# EAGLE design voltage_multiplier_v10 (EAGLE 6.5.0)
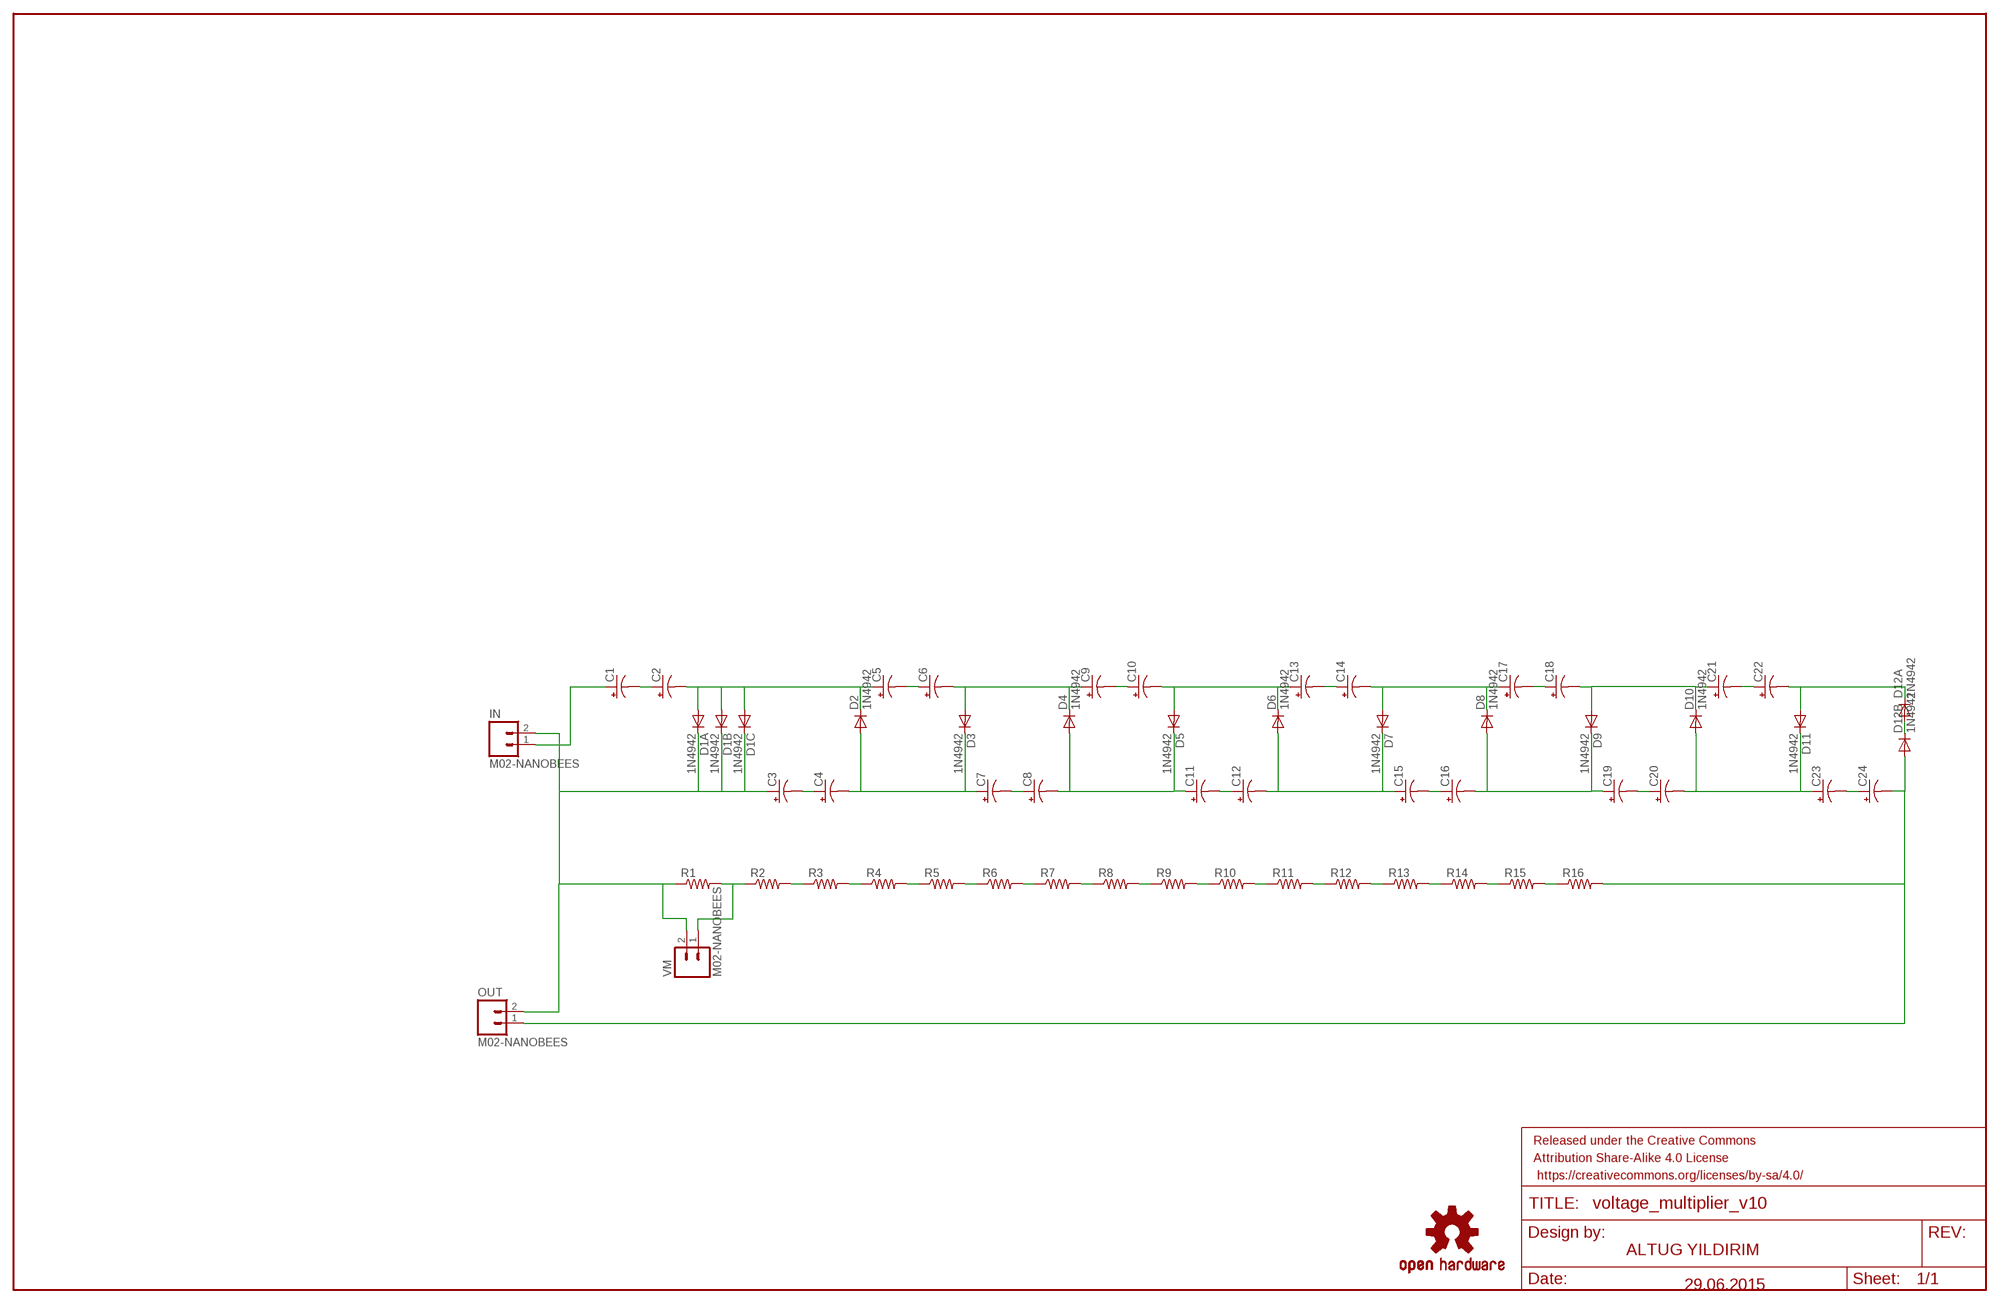
[diagram p0: schematic, sheet 1]

## Parts
C1  CAP_POLPTH3  [CPOL-RADIAL-1000UF-63V]
C2  CAP_POLPTH3  [CPOL-RADIAL-1000UF-63V]
C3  CAP_POLPTH3  [CPOL-RADIAL-1000UF-63V]
C4  CAP_POLPTH3  [CPOL-RADIAL-1000UF-63V]
C5  CAP_POLPTH3  [CPOL-RADIAL-1000UF-63V]
C6  CAP_POLPTH3  [CPOL-RADIAL-1000UF-63V]
C7  CAP_POLPTH3  [CPOL-RADIAL-1000UF-63V]
C8  CAP_POLPTH3  [CPOL-RADIAL-1000UF-63V]
C9  CAP_POLPTH3  [CPOL-RADIAL-1000UF-63V]
C10  CAP_POLPTH3  [CPOL-RADIAL-1000UF-63V]
C11  CAP_POLPTH3  [CPOL-RADIAL-1000UF-63V]
C12  CAP_POLPTH3  [CPOL-RADIAL-1000UF-63V]
C13  CAP_POLPTH3  [CPOL-RADIAL-1000UF-63V]
C14  CAP_POLPTH3  [CPOL-RADIAL-1000UF-63V]
C15  CAP_POLPTH3  [CPOL-RADIAL-1000UF-63V]
C16  CAP_POLPTH3  [CPOL-RADIAL-1000UF-63V]
C17  CAP_POLPTH3  [CPOL-RADIAL-1000UF-63V]
C18  CAP_POLPTH3  [CPOL-RADIAL-1000UF-63V]
C19  CAP_POLPTH3  [CPOL-RADIAL-1000UF-63V]
C20  CAP_POLPTH3  [CPOL-RADIAL-1000UF-63V]
C21  CAP_POLPTH3  [CPOL-RADIAL-1000UF-63V]
C22  CAP_POLPTH3  [CPOL-RADIAL-1000UF-63V]
C23  CAP_POLPTH3  [CPOL-RADIAL-1000UF-63V]
C24  CAP_POLPTH3  [CPOL-RADIAL-1000UF-63V]
D1A  1N4942  [DO41-10]
D1B  1N4942  [DO41-10]
D1C  1N4942  [DO41-10]
D2  1N4942  [DO41-10]
D3  1N4942  [DO41-10]
D4  1N4942  [DO41-10]
D5  1N4942  [DO41-10]
D6  1N4942  [DO41-10]
D7  1N4942  [DO41-10]
D8  1N4942  [DO41-10]
D9  1N4942  [DO41-10]
D10  1N4942  [DO41-10]
D11  1N4942  [DO41-10]
D12A  1N4942  [DO41-10]
D12B  1N4942  [DO41-10]
FRAME1  FRAME-LEDGER  [CREATIVE_COMMONS]
IN  M02-NANOBEES  [M02-NANOBEES]
LOGO1  OSHW-LOGOM  [OSHW-LOGO-M]
OUT  M02-NANOBEES  [M02-NANOBEES]
R1  RESISTORPTH-1/4W  [AXIAL-0.4]
R2  RESISTORPTH-1/4W  [AXIAL-0.4]
R3  RESISTORPTH-1/4W  [AXIAL-0.4]
R4  RESISTORPTH-1/4W  [AXIAL-0.4]
R5  RESISTORPTH-1/4W  [AXIAL-0.4]
R6  RESISTORPTH-1/4W  [AXIAL-0.4]
R7  RESISTORPTH-1/4W  [AXIAL-0.4]
R8  RESISTORPTH-1/4W  [AXIAL-0.4]
R9  RESISTORPTH-1/4W  [AXIAL-0.4]
R10  RESISTORPTH-1/4W  [AXIAL-0.4]
R11  RESISTORPTH-1/4W  [AXIAL-0.4]
R12  RESISTORPTH-1/4W  [AXIAL-0.4]
R13  RESISTORPTH-1/4W  [AXIAL-0.4]
R14  RESISTORPTH-1/4W  [AXIAL-0.4]
R15  RESISTORPTH-1/4W  [AXIAL-0.4]
R16  RESISTORPTH-1/4W  [AXIAL-0.4]
VM  M02-NANOBEES  [M02-NANOBEES]

## Nets
N$1: C5.2(-) C6.1(+)
N$2: C2.2(-) C5.1(+) D1A.A D1B.A D1C.A D2.C
N$3: C1.2(-) C2.1(+)
N$4: C3.1(+) D1A.C D1B.C D1C.C IN.2 OUT.2 R1.P$1 VM.2
N$5: C3.2(-) C4.1(+)
N$6: C4.2(-) C7.1(+) D2.A D3.C
N$7: C1.1(+) IN.1
N$8: C6.2(-) C9.1(+) D3.A D4.C
N$9: C7.2(-) C8.1(+)
N$10: C9.2(-) C10.1(+)
N$11: C13.2(-) C14.1(+)
N$12: C8.2(-) C11.1(+) D4.A D5.C
N$13: C10.2(-) C13.1(+) D5.A D6.C
N$14: D12A.A D12B.C
N$15: C18.2(-) C21.1(+) D9.A D10.C
N$16: C11.2(-) C12.1(+)
N$17: C12.2(-) C15.1(+) D6.A D7.C
N$18: C14.2(-) C17.1(+) D7.A D8.C
N$19: C15.2(-) C16.1(+)
N$20: C17.2(-) C18.1(+)
N$21: C16.2(-) C19.1(+) D8.A D9.C
N$22: C24.2(-) D12B.A OUT.1 R16.P$2
N$23: C21.2(-) C22.1(+)
N$24: C19.2(-) C20.1(+)
N$25: C20.2(-) C23.1(+) D10.A D11.C
N$26: C22.2(-) D11.A D12A.C
N$27: C23.2(-) C24.1(+)
N$28: R1.P$2 R2.P$1 VM.1
N$29: R2.P$2 R3.P$1
N$30: R3.P$2 R4.P$1
N$31: R4.P$2 R5.P$1
N$32: R5.P$2 R6.P$1
N$33: R6.P$2 R7.P$1
N$34: R7.P$2 R8.P$1
N$35: R8.P$2 R9.P$1
N$36: R9.P$2 R10.P$1
N$37: R10.P$2 R11.P$1
N$38: R11.P$2 R12.P$1
N$39: R12.P$2 R13.P$1
N$40: R13.P$2 R14.P$1
N$41: R14.P$2 R15.P$1
N$42: R15.P$2 R16.P$1

## Notes on the sheet
- ALTUG YILDIRIM
- 29.06.2015

## Library data of the parts
C1-C24 = SparkFun-Capacitors:CAP_POL: Capacitor Polarized These are standard SMD and PTH capacitors. Normally 10uF, 47uF, and 100uF in electrolytic and tantalum varieties. Always verify the external diameter of the through hole cap, it varies with capacity, voltage, and manufacturer. The EIA devices should be standard.
D1A D1B D1C D2-D11 D12A D12B = diode:1N4942: DIODE 1.0 A, 200 V, 150 ns
FRAME1 = SparkFun-Aesthetics:FRAME-LEDGER: Schematic Frame Standard 11x14 US Ledger frame
IN OUT VM = SparkFun-Connectors:M02-NANOBEES
LOGO1 = SparkFun-Aesthetics:OSHW-LOGO: Open Source Hardware Logo This logo indicates the piece of hardware it is found on incorporates a OSHW license and/or adheres to the definition of open source hardware found here: http://freedomdefined.org/OSHW
R1-R16 = SparkFun-Resistors:RESISTOR: Resistor Basic schematic elements and footprints for 0603, 1206, and PTH resistors.

## Board
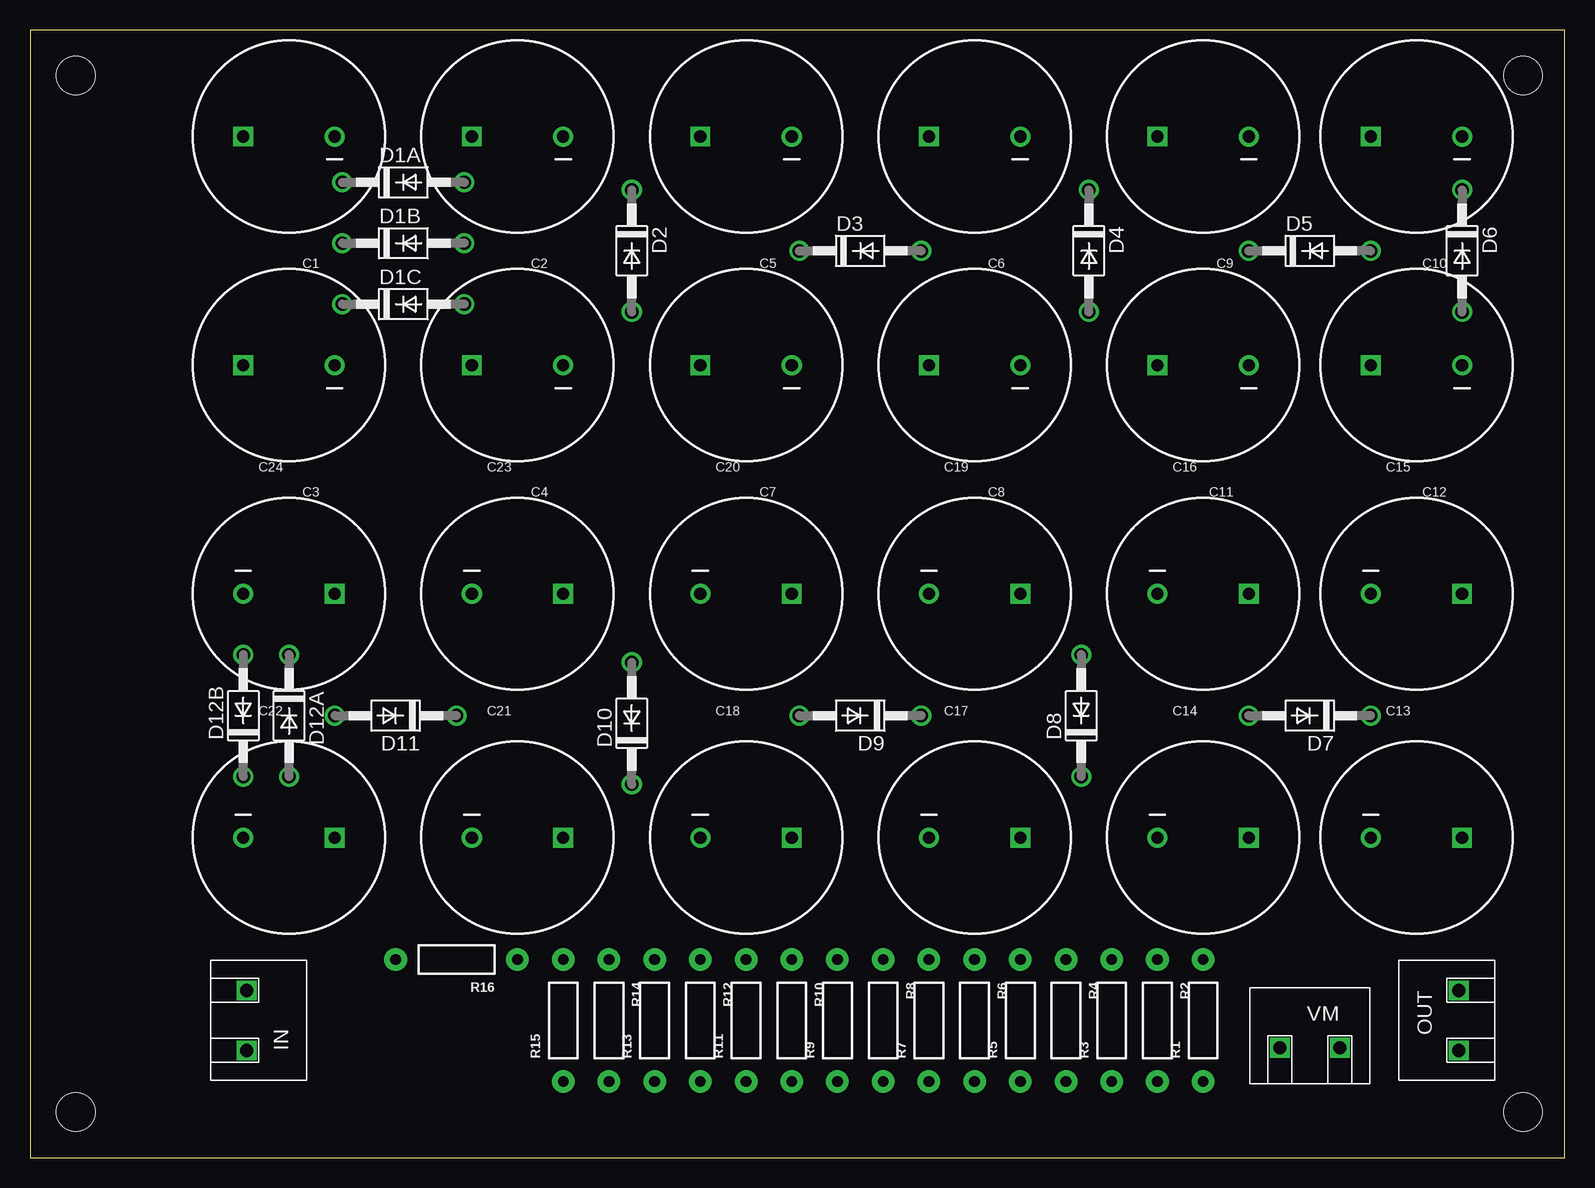
[diagram p1: board, top side]
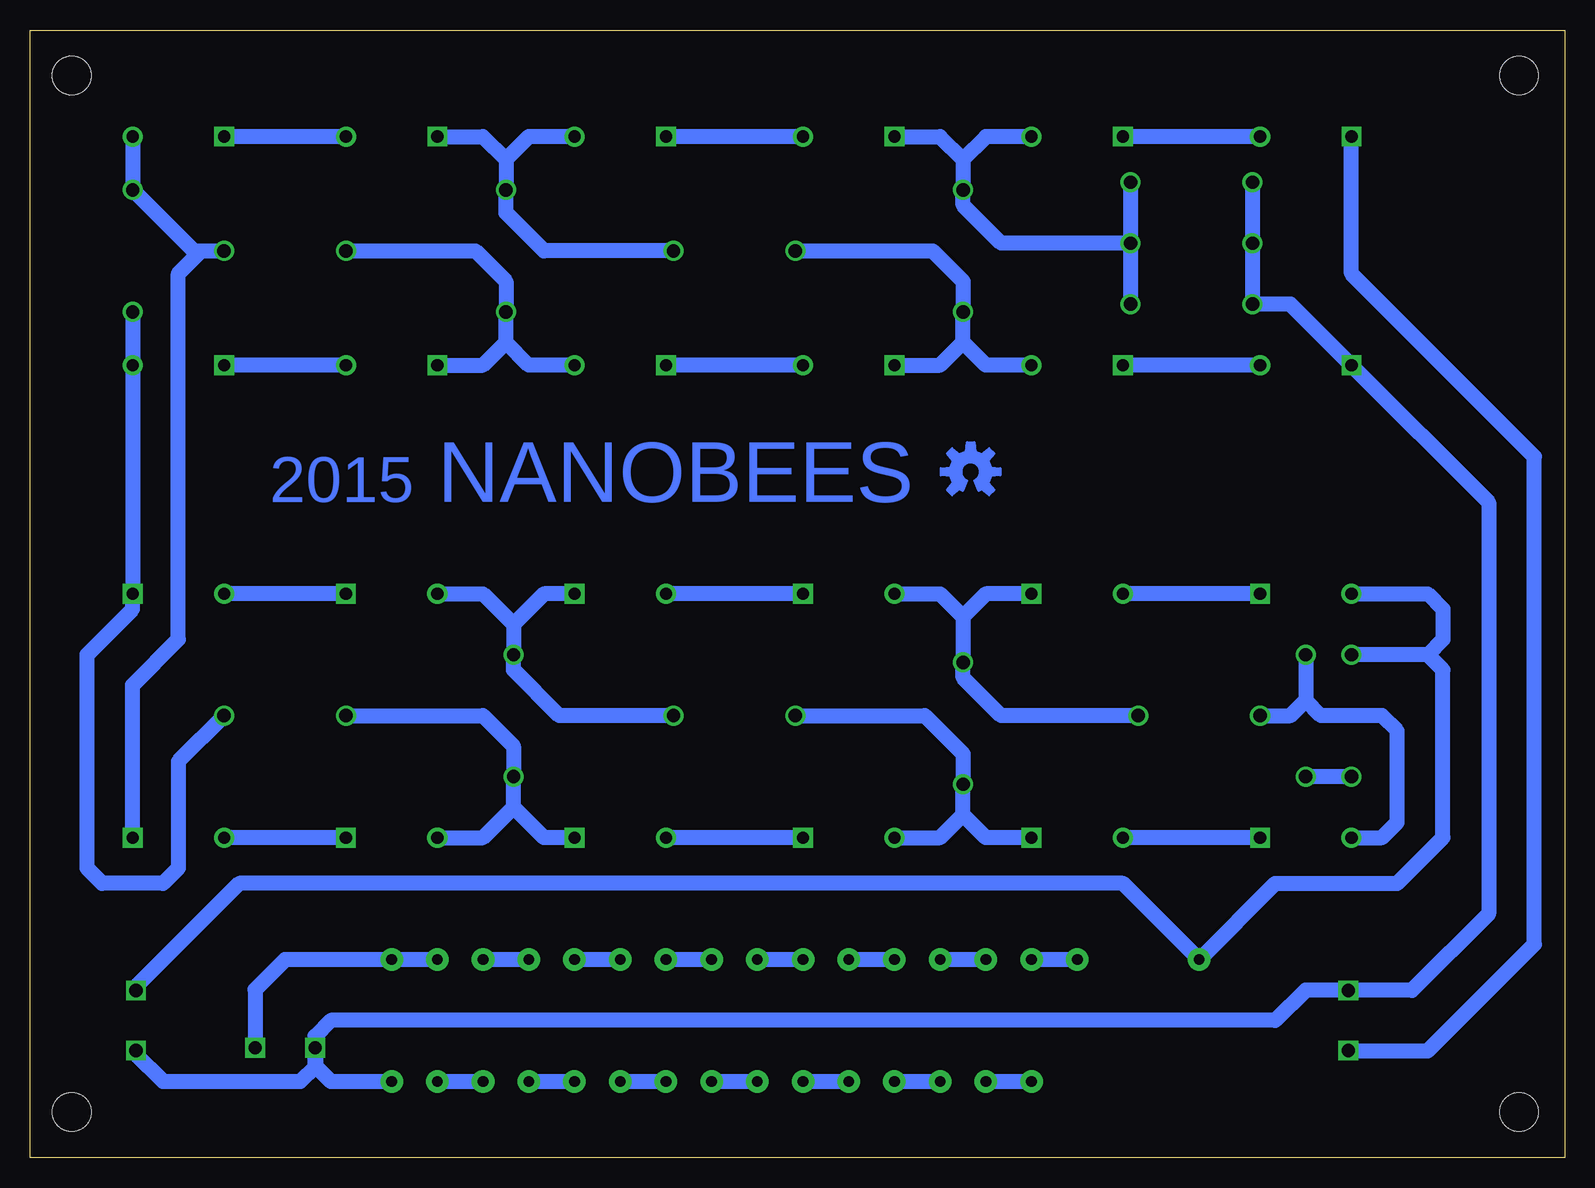
[diagram p2: board, bottom side, seen from below]

Size 127.94 x 93.97 mm. Coordinates in mm from the lower left corner, seen from the top.
Outline: 0,0 127.94,0 127.94,93.97 0,93.97 0,0
Copper layers (1*16): Top 0.035mm / dielectric 1.5mm / Bottom 0.035mm
Design rules "default": minimum track width 10mil, minimum drill 24mil, track to track 8mil, track to pad 8mil, pad to pad 8mil, via to via 8mil, smd to smd 8mil, copper to edge 40mil, drill to drill 8mil, minimum pad ring 10mil, minimum via ring 8mil, stop-mask expansion 4mil, vias tented up to drill 0mil, thermal gap 10mil
Holes 3.2 mm at 3.81,90.17 3.81,3.81 124.46,90.17 124.46,3.81

### Footprints (pad centres in the part's own frame; a part is rotated, then mirrored left to right if it is on the bottom)
CPOL-RADIAL-1000UF-63V = drill 1.016 pad 1.651 square: 1 3.81,0 | drill 1.016 pad 1.676: 2 -3.81,0
DO41-10 = drill 1.118: A 5.08,0; C -5.08,0
M02-NANOBEES = drill 1.1 pad 1.5 square: 1 -2.5,1; 2 2.5,1
AXIAL-0.4 = drill 0.9 pad 1.88: P$1 -5.08,0; P$2 5.08,0

### Placement (x,y rotation side)
C1  21.59,85.09 180 top
C2  40.64,85.09 180 top
C3  21.59,66.04 180 top
C4  40.64,66.04 180 top
C5  59.69,85.09 180 top
C6  78.74,85.09 180 top
C7  59.69,66.04 180 top
C8  78.74,66.04 180 top
C9  97.79,85.09 180 top
C10  115.57,85.09 180 top
C11  97.79,66.04 180 top
C12  115.57,66.04 180 top
C13  115.57,26.67 0 top
C14  97.79,26.67 0 top
C15  115.57,46.99 0 top
C16  97.79,46.99 0 top
C17  78.74,26.67 0 top
C18  59.69,26.67 0 top
C19  78.74,46.99 0 top
C20  59.69,46.99 0 top
C21  40.64,26.67 0 top
C22  21.59,26.67 0 top
C23  40.64,46.99 0 top
C24  21.59,46.99 0 top
D1A  31.12,81.28 0 top
D1B  31.12,76.2 0 top
D1C  31.12,71.12 0 top
D2  50.16,75.56 270 top
D3  69.22,75.56 0 top
D4  88.27,75.56 270 top
D5  106.68,75.56 0 top
D6  119.38,75.56 270 top
D7  106.68,36.83 180 top
D8  87.63,36.83 90 top
D9  69.22,36.83 180 top
D10  50.16,36.2 90 top
D11  30.48,36.83 180 top
D12A  21.59,36.83 270 top
D12B  17.78,36.83 90 top
FRAME1  39.37,-7.62 0 top  (outside the outline)
IN  19.05,11.43 90 top
LOGO1  49.53,57.15 0 top
OUT  118.11,11.43 270 top
R1  97.79,11.43 90 top
R2  93.98,11.43 270 top
R3  90.17,11.43 90 top
R4  86.36,11.43 270 top
R5  82.55,11.43 90 top
R6  78.74,11.43 270 top
R7  74.93,11.43 90 top
R8  71.12,11.43 270 top
R9  67.31,11.43 90 top
R10  63.5,11.43 270 top
R11  59.69,11.43 90 top
R12  55.88,11.43 270 top
R13  52.07,11.43 90 top
R14  48.26,11.43 270 top
R15  44.45,11.43 90 top
R16  35.56,16.51 180 top
VM  106.68,10.16 180 top

### Tracks (layer width: path | path; a pad name or v marks a point on that pad's centre or on a via)
N$1
  Bottom 1.27: C5.2 C6.1
N$2
  Bottom 1.27: D1B.A D1C.A | C5.1 52.07,85.09 50.16,83.19 | 50.16,83.19 D2.C 50.16,79.38 46.99,76.2 D1B.A | C2.2 48.26,85.09 50.16,83.19 | D1A.A D1B.A
N$3
  Bottom 1.27: C1.2 C2.1
N$4
  Bottom 1.27: D1A.C D1B.C D1C.C 22.86,71.12 C3.1 6.35,54.61 6.35,20.32 12.74,13.93 IN.2 18.09,13.97 21.59,13.97 24.13,11.43 102.87,11.43 104.18,10.12 VM.2 | VM.2 104.18,7.58 105.41,6.35 116.84,6.35 119.11,8.62 OUT.2 | VM.2 104.14,9.12 104.14,7.62 102.87,6.35 R1.P$1
N$5
  Bottom 1.27: C3.2 C4.1
N$6
  Bottom 1.27: C4.2 48.26,66.04 50.16,67.95 | 50.16,67.95 D2.A 50.16,73.03 52.7,75.56 D3.C | C7.1 52.07,66.04 50.16,67.95
N$7
  Bottom 1.27: IN.1 18.01,8.89 11.43,8.89 2.54,17.78 2.54,58.42 17.78,73.66 C1.1
N$8
  Bottom 1.27: C6.2 86.36,85.09 88.27,83.19 | 88.27,83.19 D4.C 88.27,78.74 85.09,75.56 D3.A | C9.1 90.17,85.09 88.27,83.19
N$9
  Bottom 1.27: C7.2 C8.1
N$10
  Bottom 1.27: C9.2 C10.1
N$11
  Bottom 1.27: C14.1 C13.2
N$12
  Bottom 1.27: C8.2 86.36,66.04 88.27,67.95 | 88.27,67.95 88.27,69.85 D4.A 88.27,73.03 90.81,75.56 D5.C | C11.1 90.17,66.04 88.27,67.95
N$13
  Bottom 1.27: 113.67,75.56 115.57,73.66 115.57,43.18 119.38,39.37 C13.1 | 113.67,75.56 D5.A | 113.67,75.56 114.3,75.56 D6.C C10.2
N$14
  Bottom 1.27: D12B.C D12A.A
N$15
  Bottom 1.27: C21.1 48.26,26.67 50.16,28.57 | 50.16,28.57 D10.C 50.16,33.66 53.34,36.83 D9.A | C18.2 52.07,26.67 50.16,28.57
N$16
  Bottom 1.27: C11.2 C12.1
N$17
  Bottom 1.27: D6.A C12.2 C15.1 119.38,45.72 123.19,41.91 123.19,24.13 121.92,22.86 116.84,22.86 115.57,24.13 115.57,33.02 D7.C
N$18
  Bottom 1.27: C17.1 85.09,26.67 87.63,29.21 | 87.63,29.21 D8.C 87.63,34.29 90.17,36.83 D7.A | C14.2 90.17,26.67 87.63,29.21
N$19
  Bottom 1.27: C16.1 C15.2
N$20
  Bottom 1.27: C18.1 C17.2
N$21
  Bottom 1.27: C19.1 85.09,46.99 87.63,44.45 | 87.63,44.45 D8.A 87.63,40.64 83.82,36.83 D9.C | C16.2 90.17,46.99 87.63,44.45
N$22
  Bottom 1.27: 11.43,41.91 10.16,40.64 10.16,26.67 13.97,22.86 24.13,22.86 R16.P$2 36.83,22.86 110.49,22.86 119.11,14.24 OUT.1 | 11.43,41.91 D12B.A | C24.2 11.43,46.99 10.16,45.72 10.16,43.18 11.43,41.91
N$23
  Bottom 1.27: C22.1 C21.2
N$24
  Bottom 1.27: C20.1 C19.2
N$25
  Bottom 1.27: C23.1 48.26,46.99 50.16,45.09 | 50.16,45.09 D10.A 50.16,40.01 46.99,36.83 D11.C | C20.2 52.07,46.99 50.16,45.09
N$26
  Bottom 1.27: C22.2 15.24,26.67 13.97,27.94 13.97,35.56 15.24,36.83 20.32,36.83 21.59,38.1 | D12A.C 21.59,38.1 | D11.A 22.86,36.83 21.59,38.1
N$27
  Bottom 1.27: C24.1 C23.2
N$28
  Bottom 1.27: VM.1 109.18,14.01 106.68,16.51 R1.P$2 R2.P$1
N$29
  Bottom 1.27: R2.P$2 R3.P$1
N$30
  Bottom 1.27: R4.P$1 R3.P$2
N$31
  Bottom 1.27: R4.P$2 R5.P$1
N$32
  Bottom 1.27: R6.P$1 R5.P$2
N$33
  Bottom 1.27: R6.P$2 R7.P$1
N$34
  Bottom 1.27: R8.P$1 R7.P$2
N$35
  Bottom 1.27: R8.P$2 R9.P$1
N$36
  Bottom 1.27: R10.P$1 R9.P$2
N$37
  Bottom 1.27: R10.P$2 R11.P$1
N$38
  Bottom 1.27: R12.P$1 R11.P$2
N$39
  Bottom 1.27: R12.P$2 R13.P$1
N$40
  Bottom 1.27: R14.P$1 R13.P$2
N$41
  Bottom 1.27: R14.P$2 R15.P$1
N$42
  Bottom 1.27: R16.P$1 R15.P$2

### Text on the board
Bottom: NANOBEES | 2015